# Altium project mcHF_rf.PrjPCB
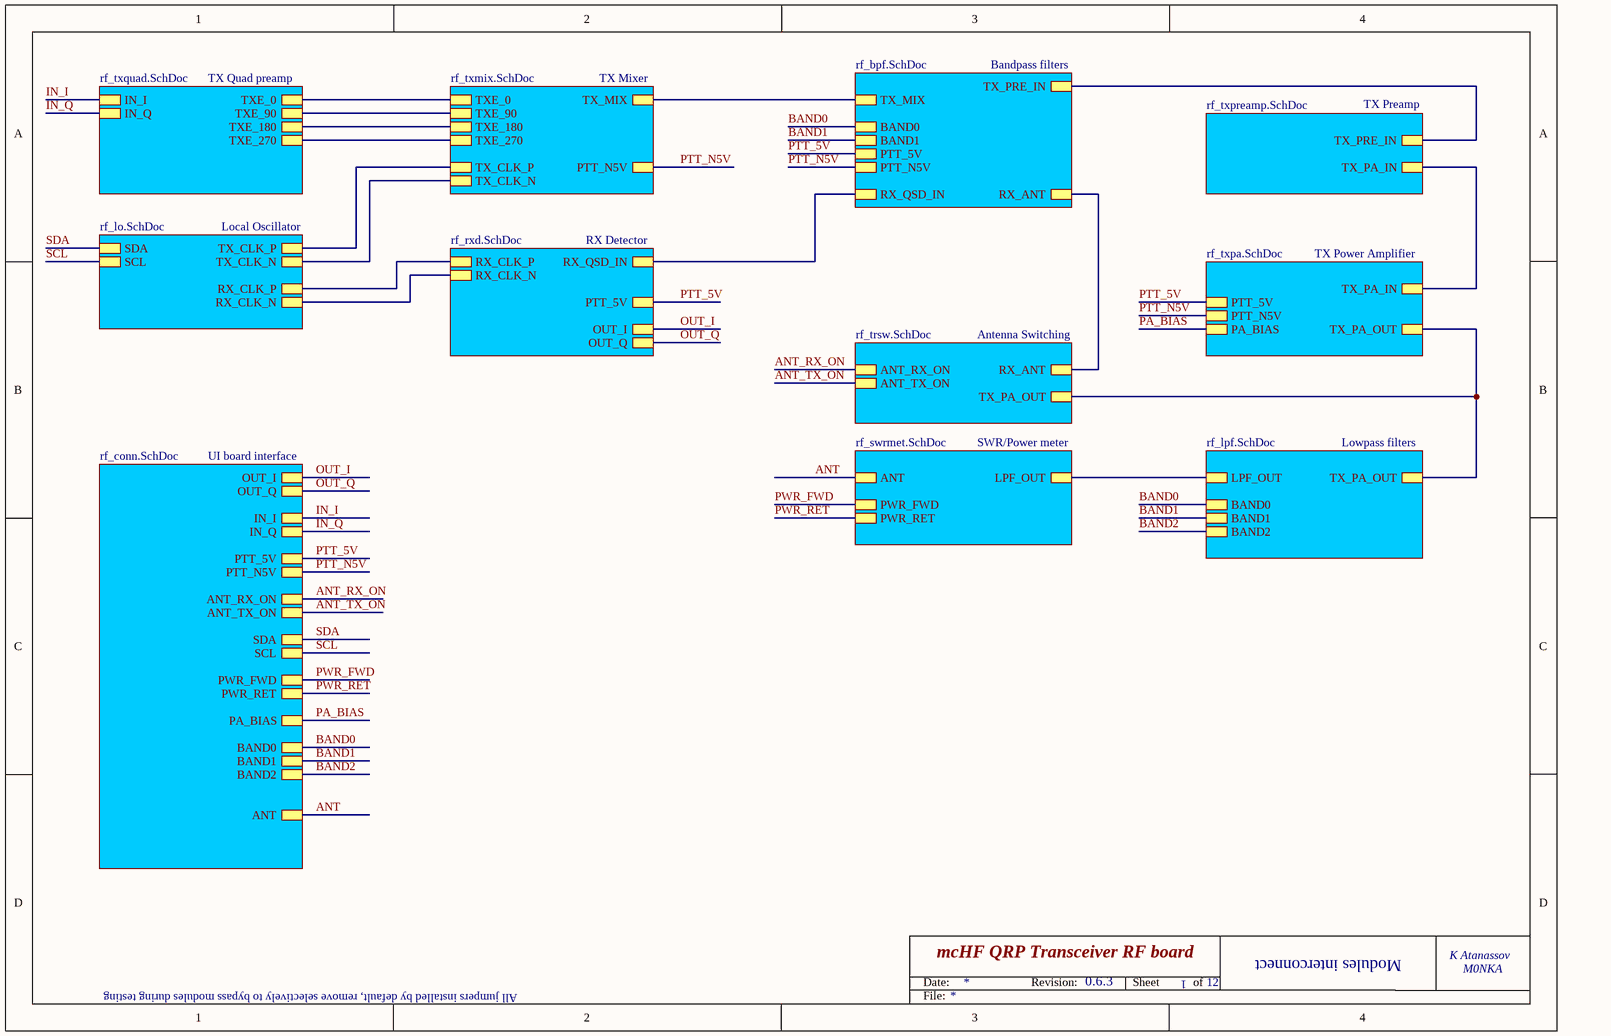
[diagram p0: rf_main.SchDoc]
6 sheets, 174 parts. Net scope: hierarchical (ports join the sheet entries above them; power ports are global).
Board file: rf_main.PcbDoc
Sheets:
  rf_main.SchDoc
    TX Power Amplifier = rf_txpa.SchDoc
    Bandpass filters = rf_bpf.SchDoc
    UI board interface = rf_conn.SchDoc
    TX Mixer = rf_txmix.SchDoc
    Antenna Switching = rf_trsw.SchDoc

## Sheet rf_main.SchDoc: mcHF QRP Transceiver RF board
size A4; Author: K Atanassov; CompanyName: M0NKA; Revision: 0.6.3; SheetTotal: 12

### Sub-sheets
Antenna Switching = rf_trsw.SchDoc: RX_ANT, ANT_RX_ON, ANT_TX_ON, TX_PA_OUT
Bandpass filters = rf_bpf.SchDoc: RX_QSD_IN, BAND0, BAND1, PTT_5V, RX_ANT, TX_MIX, TX_PRE_IN, PTT_N5V
Local Oscillator = rf_lo.SchDoc (file not in this document): SDA, SCL, RX_CLK_N, RX_CLK_P, TX_CLK_P, TX_CLK_N
Lowpass filters = rf_lpf.SchDoc (file not in this document): TX_PA_OUT, LPF_OUT, BAND0, BAND1, BAND2
RX Detector = rf_rxd.SchDoc (file not in this document): RX_QSD_IN, OUT_I, OUT_Q, PTT_5V, RX_CLK_N, RX_CLK_P
SWR/Power meter = rf_swrmet.SchDoc (file not in this document): ANT, LPF_OUT, PWR_FWD, PWR_RET
TX Mixer = rf_txmix.SchDoc: PTT_N5V, TX_MIX, TXE_270, TXE_180, TXE_90, TXE_0, TX_CLK_P, TX_CLK_N
TX Power Amplifier = rf_txpa.SchDoc: TX_PA_IN, PA_BIAS, TX_PA_OUT, PTT_N5V, PTT_5V
TX Preamp = rf_txpreamp.SchDoc (file not in this document): TX_PRE_IN, TX_PA_IN
TX Quad preamp = rf_txquad.SchDoc (file not in this document): IN_I, IN_Q, TXE_0, TXE_90, TXE_180, TXE_270
UI board interface = rf_conn.SchDoc: OUT_I, OUT_Q, IN_I, IN_Q, PTT_5V, PTT_N5V, SDA, SCL, PWR_FWD, PWR_RET, PA_BIAS, BAND0, BAND1, ANT, BAND2, ANT_RX_ON, ANT_TX_ON

### Nets
ANT: sheet UI board interface/ANT, sheet SWR/Power meter/ANT
ANT_RX_ON: sheet UI board interface/ANT_RX_ON, sheet Antenna Switching/ANT_RX_ON
ANT_TX_ON: sheet UI board interface/ANT_TX_ON, sheet Antenna Switching/ANT_TX_ON
BAND0: sheet Bandpass filters/BAND0, sheet Lowpass filters/BAND0, sheet UI board interface/BAND0
BAND1: sheet Bandpass filters/BAND1, sheet Lowpass filters/BAND1, sheet UI board interface/BAND1
BAND2: sheet Lowpass filters/BAND2, sheet UI board interface/BAND2
IN_I: sheet TX Quad preamp/IN_I, sheet UI board interface/IN_I
IN_Q: sheet TX Quad preamp/IN_Q, sheet UI board interface/IN_Q
OUT_I: sheet RX Detector/OUT_I, sheet UI board interface/OUT_I
OUT_Q: sheet RX Detector/OUT_Q, sheet UI board interface/OUT_Q
PA_BIAS: sheet TX Power Amplifier/PA_BIAS, sheet UI board interface/PA_BIAS
PTT_5V: sheet TX Power Amplifier/PTT_5V, sheet RX Detector/PTT_5V, sheet Bandpass filters/PTT_5V, sheet UI board interface/PTT_5V  [project net PTT]
PTT_N5V: sheet TX Power Amplifier/PTT_N5V, sheet Bandpass filters/PTT_N5V, sheet UI board interface/PTT_N5V, sheet TX Mixer/PTT_N5V  [project net PTT_N]
PWR_FWD: sheet UI board interface/PWR_FWD, sheet SWR/Power meter/PWR_FWD
PWR_RET: sheet UI board interface/PWR_RET, sheet SWR/Power meter/PWR_RET
SCL: sheet Local Oscillator/SCL, sheet UI board interface/SCL
SDA: sheet Local Oscillator/SDA, sheet UI board interface/SDA
NetC1_1: sheet Bandpass filters/RX_ANT, sheet Antenna Switching/RX_ANT
NetC2_1: sheet Bandpass filters/TX_MIX, sheet TX Mixer/TX_MIX
NetC23_1: sheet RX Detector/RX_QSD_IN, sheet Bandpass filters/RX_QSD_IN
NetC24_1: sheet Bandpass filters/TX_PRE_IN, sheet TX Preamp/TX_PRE_IN
NetC78_2: sheet TX Power Amplifier/TX_PA_OUT, sheet Lowpass filters/TX_PA_OUT, sheet Antenna Switching/TX_PA_OUT
NetR63_1: sheet TX Quad preamp/TXE_0, sheet TX Mixer/TXE_0
NetR64_1: sheet TX Quad preamp/TXE_180, sheet TX Mixer/TXE_180
NetR65_1: sheet TX Quad preamp/TXE_90, sheet TX Mixer/TXE_90
NetR66_1: sheet TX Quad preamp/TXE_270, sheet TX Mixer/TXE_270
NetR71_2: sheet Local Oscillator/TX_CLK_P, sheet TX Mixer/TX_CLK_P
NetR72_2: sheet Local Oscillator/TX_CLK_N, sheet TX Mixer/TX_CLK_N
NetT5_6: sheet TX Power Amplifier/TX_PA_IN, sheet TX Preamp/TX_PA_IN
(unnamed): sheet RX Detector/RX_CLK_N, sheet Local Oscillator/RX_CLK_N
(unnamed): sheet RX Detector/RX_CLK_P, sheet Local Oscillator/RX_CLK_P
(unnamed): sheet Lowpass filters/LPF_OUT, sheet SWR/Power meter/LPF_OUT

### Notes on the sheet
- All jumpers installed by default, remove selectively to bypass modules during testing
- 1
- Modules interconnect
- Date:
- Revision:
- Sheet
- of
- File:

## Sheet rf_txpa.SchDoc: mcHF QRP Transceiver RF board
size A4; Author: K Atanassov; CompanyName: M0NKA; Revision: 0.6.3; SheetTotal: 12
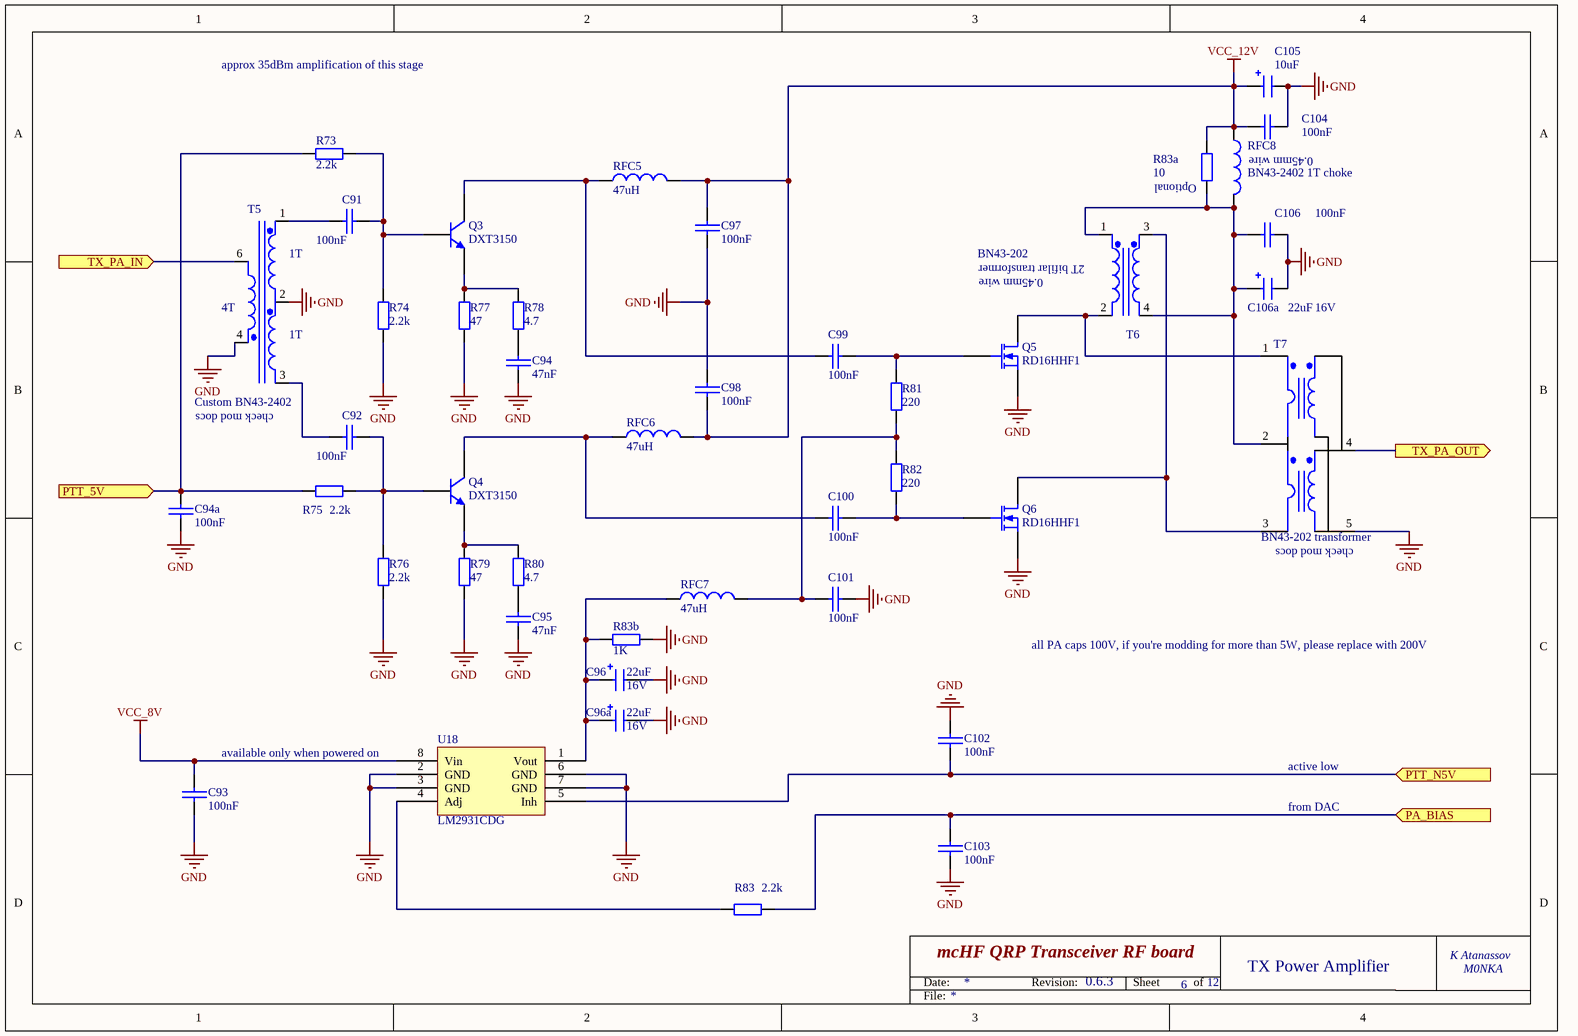
[diagram p1: rf_txpa.SchDoc]

### Parts
C91  100nF  [0805-Pro]
C92  100nF  [0805-Pro]
C93  100nF  [0805-Pro]
C94  47nF  [0805-Pro]
C94a  100nF  [0805-Pro]
C95  47nF  [0805-Pro]
C96  22uF  Voltage: 16V  [1206_Elec_Cap_N]
C96a  22uF  Voltage: 16V  [1206_Elec_Cap_N]
C97  100nF  [0805-Pro]
C98  100nF  [0805-Pro]
C99  100nF  [0805-Pro]
C100  100nF  [0805-Pro]
C101  100nF  [0805-Pro]
C102  100nF  [0805-Pro]
C103  100nF  [0805-Pro]
C104  100nF  [0805-Pro]
C105  10uF  [1206_Elec_Cap_N]
C106  100nF  [0805-Pro]
C106a  22uF  Voltage: 16V  [1206_Elec_Cap_N]
Q3  DXT3150  [SOT89L_new]
Q4  DXT3150  [SOT89L_new]
Q5  RD16HHF1  [TO-220RF_dual]
Q6  RD16HHF1  [TO-220RF_dual]
R73  2.2k  [0805-Pro]
R74  2.2k  [0805-Pro]
R75  2.2k  [0805-Pro]
R76  2.2k  [0805-Pro]
R77  47  [0805-Pro]
R78  4.7  [0805-Pro]
R79  47  [0805-Pro]
R80  4.7  [0805-Pro]
R81  220  [0805-Pro]
R82  220  [0805-Pro]
R83  2.2k  [0805-Pro]
R83a  10  [0805-Pro]
R83b  1K  [0805-Pro]
RFC5  47uH  [0805-Pro]
RFC6  47uH  [0805-Pro]
RFC7  47uH  [0805-Pro]
RFC8  BN43-2402 1T choke  [F_Bead]
T5  Custom BN43-2402  [SOP5_NEW1thr]
T6  BN43-202  [PA_TRM_b1]
T7  BN43-202 transformer  [PA_TRM_4m]
U18  LM2931CDG  [SO-8-Pro]

### Ports
PA_BIAS (in), PTT_5V (in), PTT_N5V (in), TX_PA_IN (in), TX_PA_OUT (out)

### Nets
GND: C93.2 C94.2 C94a.2 C95.2 C96.2 C96a.2 C97.2 C98.1 C101.1 C102.1 C103.2 C104.1 C105.2 C106.1 C106a.2 Q5.2(S) Q6.2(S) R74.2 R76.2 R77.1 R79.1 R83b.1 T5.2(SecCmn) T5.4(Pri-) T7.5(Sec-) U18.2(GND) U18.3(GND) U18.6(GND) U18.7(GND)
VCC_8V: C93.1 U18.8(Vin)
VCC_12V: C97.1 C98.2 C104.2 C105.1 R83a.2 RFC5.2 RFC6.2 RFC8.1
PA_BIAS: C103.1 R83.2 ; port PA_BIAS
PTT: C94a.1 R73.2 R75.1 ; port PTT_5V
PTT_N: C102.2 U18.5(Inh) ; port PTT_N5V
NetC78_2: T7.4(Sec+) ; port TX_PA_OUT
NetC91_1: C91.1 Q3.1(B) R73.1 R74.1
NetC91_2: C91.2 T5.1(Sec0)
NetC92_1: C92.1 Q4.1(B) R75.2 R76.1
NetC92_2: C92.2 T5.3(Sec180)
NetC94_1: C94.1 R78.1
NetC95_1: C95.1 R80.1
NetC96_1: C96.1 C96a.1 R83b.2 RFC7.1 U18.1(Vout)
NetC99_1: C99.1 Q5.1(G) R81.2
NetC99_2: C99.2 Q3.2(C) RFC5.1
NetC100_1: C100.1 Q6.1(G) R82.1
NetC100_2: C100.2 Q4.2(C) RFC6.1
NetC101_2: C101.2 R81.1 R82.2 RFC7.2
NetC106_2: C106.2 C106a.1 R83a.1 RFC8.2 T6.1(Pri+) T6.4(Sec-) T7.2(Pri_Common)
NetQ3_3: Q3.3(E) R77.2 R78.2
NetQ4_3: Q4.3(E) R79.2 R80.2
NetQ5_3: Q5.3(D) T6.2(Pri-) T7.1(Pri_0_deg)
NetQ6_3: Q6.3(D) T6.3(Sec+) T7.3(Pri_180_deg)
NetR83_1: R83.1 U18.4(Adj)
NetT5_6: T5.6(Pri+) ; port TX_PA_IN

### Notes on the sheet
- approx 35dBm amplification of this stage
- (near R83a) Optional
- (near RFC8) 0.45mm wire
- (near T5) 4T
- (near T5) 1T
- (near T6) 2T bifilar transformer
- 0.45mm wire
- (near T5) check mod docs
- (near T7) check mod docs
- all PA caps 100V, if you're modding for more than 5W, please replace with 200V
- available only when powered on
- active low
- from DAC
- 9
- TX Power Amplifier
- Date:
- Revision:
- Sheet
- of
- File:

### Library data of the parts
C91-C93 C94a C97-C104 C106 = CAP: Capacitor; Order: FN 252-2090; Voltage: 100V; QT Order: QCC-00154; Price: 0.068
C94 C95 = CAP: Capacitor; Order: FN 152-0303; QT Order: QCC-00101; Price: 0.03
C96 C96a C106a = CAP-POL: Electrolitic capacitor; Order: FN 197-294; QT Order: QCC-00202; Price: 0.235
C105 = CAP-POL: Electrolitic capacitor; Order: FN 233-3009; QT Order: QCC-00166; Price: 0.204
Q3 Q4 = DXT3150: BIPOLAR, TRANSISTOR, NPN, SOT-89; Order: FN 171-3880; Price: 0.221
Q5 Q6 = RD16HHF1: Silicon RF Power MOS FET; Order: EB 121171160336; Price: 7.375
R73-R76 R83 = RES: Resistor; Order: FN 188-7289; QT Order: QCR-00333; Price: 0.046
R77 R79 = RES: Resistor; Order: FN 173-8942; QT Order: QCR-00293; Price: 0.052
R78 R80 = RES: Resistor; Order: FN 205-7665; QT Order: QCR-00274; Price: 0.018
R81 R82 = RES: Resistor; Order: FN 933-2804; QT Order: QCR-00309; Price: 0.007
R83a = RES: Resistor; Order: FN 933-2421; QT Order: QCR-00279; Price: 0.013
R83b = RES: Resistor; Order: FN 157-6459; QT Order: QCR-00326; Price: 0.061
RFC5-RFC7 = TDK-NLV25T: INDUCTOR, SIGNAL LINE, 4.7UH, 1005; Order: FN 166-9895; Price: 0.166
RFC8 = FER_BEAD: Order: EB 300988432524; Price: 0.298
T5 = CX2074NL: Transformer 4:1; Order: EB 300988432524; Price: 0.298
T6 = PA_TR_b: BN43-202 bifilar transformer; Order: EB 291023830340; Price: 0.534
T7 = PA_TR_4m: BN43-202 2:3 transformer; Order: EB 291023830340; Price: 0.534
U18 = LM2931CDG: 100 mA, Adjustable Output,  LDO Voltage Regulator with  60 V Load Dump Protection; Order: FN 121-1100; Price: 0.39

## Sheet rf_bpf.SchDoc: mcHF QRP Transceiver RF board
size A4; Author: K Atanassov; CompanyName: M0NKA; Revision: 0.6.3; SheetTotal: 12
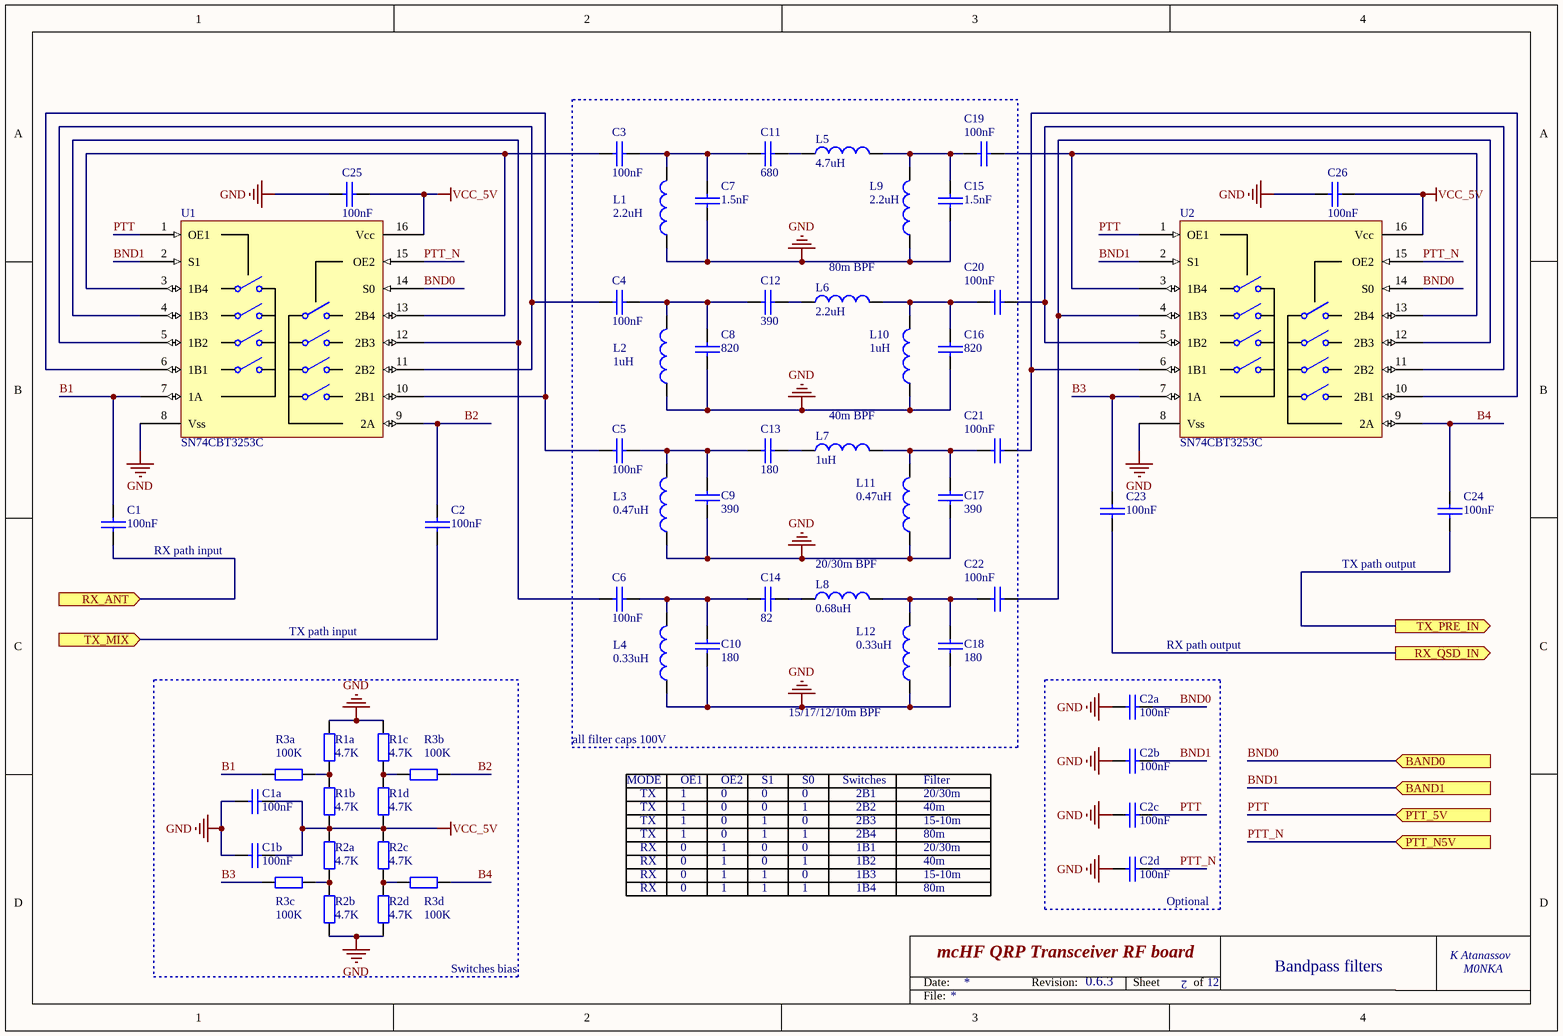
[diagram p2: rf_bpf.SchDoc]

### Parts
C1  100nF  [0805-Pro]
C1a  100nF  [0805-Pro]
C1b  100nF  [0805-Pro]
C2  100nF  [0805-Pro]
C2a  100nF  [0805-Pro]
C2b  100nF  [0805-Pro]
C2c  100nF  [0805-Pro]
C2d  100nF  [0805-Pro]
C3  100nF  [0805-Pro]
C4  100nF  [0805-Pro]
C5  100nF  [0805-Pro]
C6  100nF  [0805-Pro]
C7  1.5nF  [0805-Pro]
C8  820  [0805-Pro]
C9  390  [0805-Pro]
C10  180  [0805-Pro]
C11  680  [0805-Pro]
C12  390  [0805-Pro]
C13  180  [0805-Pro]
C14  82  [0805-Pro]
C15  1.5nF  [0805-Pro]
C16  820  [0805-Pro]
C17  390  [0805-Pro]
C18  180  [0805-Pro]
C19  100nF  [0805-Pro]
C20  100nF  [0805-Pro]
C21  100nF  [0805-Pro]
C22  100nF  [0805-Pro]
C23  100nF  [0805-Pro]
C24  100nF  [0805-Pro]
C25  100nF  [0805-Pro]
C26  100nF  [0805-Pro]
L1  2.2uH  [0805-Pro]
L2  1uH  [0805-Pro]
L3  0.47uH  [0805-Pro]
L4  0.33uH  [0805-Pro]
L5  4.7uH  [0805-Pro]
L6  2.2uH  [0805-Pro]
L7  1uH  [0805-Pro]
L8  0.68uH  [0805-Pro]
L9  2.2uH  [0805-Pro]
L10  1uH  [0805-Pro]
L11  0.47uH  [0805-Pro]
L12  0.33uH  [0805-Pro]
R1a  4.7K  [0805-Pro]
R1b  4.7K  [0805-Pro]
R1c  4.7K  [0805-Pro]
R1d  4.7K  [0805-Pro]
R2a  4.7K  [0805-Pro]
R2b  4.7K  [0805-Pro]
R2c  4.7K  [0805-Pro]
R2d  4.7K  [0805-Pro]
R3a  100K  [0805-Pro]
R3b  100K  [0805-Pro]
R3c  100K  [0805-Pro]
R3d  100K  [0805-Pro]
U1  SN74CBT3253C  [SO-16-Pro]
U2  SN74CBT3253C  [SO-16-Pro]

### Blocks framed on the sheet
Switches bias: C1a C1b R1a R1b R1c R1d R2a R2b R2c R2d R3a R3b R3c R3d
Optional: C2a C2b C2c C2d

### Ports
BAND0 (in), BAND1 (in), PTT_5V (in), PTT_N5V (in), RX_ANT (in), RX_QSD_IN (out), TX_MIX (in), TX_PRE_IN (out)

### Nets
GND: C1a.2 C1b.2 C2a.2 C2b.2 C2c.2 C2d.2 C7.2 C8.2 C9.1 C10.1 C15.2 C16.2 C17.1 C18.1 C25.2 C26.2 L1.1 L2.1 L3.1 L4.1 L9.1 L10.1 L11.1 L12.1 R1a.1 R1c.1 R2b.2 R2d.2 U1.8(Vss) U2.8(Vss)
VCC_5V: C1a.1 C1b.1 C25.1 C26.1 R1b.2 R1d.2 R2a.1 R2c.1 U1.16(Vcc) U2.16(Vcc)
B1: C1.2 R3a.1 U1.7(1A)
B2: C2.2 R3b.2 U1.9(2A)
B3: C23.2 R3c.1 U2.7(1A)
B4: C24.2 R3d.2 U2.9(2A)
BND0: C2a.1 U1.14(S0) U2.14(S0) ; port BAND0  [project net BAND0]
BND1: C2b.1 U1.2(S1) U2.2(S1) ; port BAND1  [project net BAND1]
PTT: C2c.1 U1.1(OE1) U2.1(OE1) ; port PTT_5V
PTT_N: C2d.1 U1.15(OE2) U2.15(OE2) ; port PTT_N5V
NetC1_1: C1.1 ; port RX_ANT
NetC2_1: C2.1 ; port TX_MIX
NetC3_1: C3.1 C7.1 C11.1 L1.2
NetC3_2: C3.2 U1.3(1B4) U1.13(2B4)
NetC4_1: C4.1 C8.1 C12.1 L2.2
NetC4_2: C4.2 U1.5(1B2) U1.11(2B2)
NetC5_1: C5.1 C9.2 C13.1 L3.2
NetC5_2: C5.2 U1.6(1B1) U1.10(2B1)
NetC6_1: C6.1 C10.2 C14.1 L4.2
NetC6_2: C6.2 U1.4(1B3) U1.12(2B3)
NetC11_2: C11.2 L5.1
NetC12_2: C12.2 L6.1
NetC13_2: C13.2 L7.1
NetC14_2: C14.2 L8.1
NetC15_1: C15.1 C19.2 L5.2 L9.2
NetC16_1: C16.1 C20.2 L6.2 L10.2
NetC17_2: C17.2 C21.2 L7.2 L11.2
NetC18_2: C18.2 C22.2 L8.2 L12.2
NetC19_1: C19.1 U2.3(1B4) U2.13(2B4)
NetC20_1: C20.1 U2.5(1B2) U2.11(2B2)
NetC21_1: C21.1 U2.6(1B1) U2.10(2B1)
NetC22_1: C22.1 U2.4(1B3) U2.12(2B3)
NetC23_1: C23.1 ; port RX_QSD_IN
NetC24_1: C24.1 ; port TX_PRE_IN
NetR1a_2: R1a.2 R1b.1 R3a.2
NetR1c_2: R1c.2 R1d.1 R3b.1
NetR2a_2: R2a.2 R2b.1 R3c.2
NetR2c_2: R2c.2 R2d.1 R3d.1

### Notes on the sheet
- (near L6) 80m BPF
- (near L7) 40m BPF
- (near C1) RX path input
- 20/30m BPF
- (near C24) TX path output
- TX path input
- RX path output
- (near L12) 15/17/12/10m BPF
- all filter caps 100V
- MODE
- OE1
- OE2
- S1
- S0
- Switches
- Filter
- TX
- RX
- 1
- 0
- 2B1
- 2B2
- 2B4
- 2B3
- 1B1
- 20/30m
- 40m
- 15-10m
- 80m
- 1B2
- 1B3
- 1B4
- 2
- Bandpass filters
- Date:
- Revision:
- Sheet
- of
- File:

### Library data of the parts
C1 C1a C1b C2 C2a C2b C2c C2d C3-C6 C19-C26 = CAP: Capacitor; Order: FN 252-2090; QT Order: QCC-00154; Price: 0.068
C7 C15 = CAP: Capacitor; Order: FN 221-0934; Price: 0.124
C8 C16 = CAP: Capacitor; Order: FN 174-0649; QT Order: QCC-00147; Price: 0.074
C9 C12 C17 = CAP: Capacitor; Order: FN 233-2701; QT Order: QCC-00125; Price: 0.078
C10 C13 C18 = CAP: Capacitor; Order: FN 233-2756; QT Order: QCC-00084; Price: 0.058
C11 = CAP: Capacitor; Order: FN 228-0662; Price: 0.074
C14 = CAP: Capacitor; Order: FN 174-0656; QT Order: QCC-00069; Price: 0.074
L1 L6 L9 = BPF_IND: INDUCTOR SMD; Order: FN 166-9889; Price: 0.166
L2 L7 L10 = BPF_IND: INDUCTOR SMD; Order: FN 166-9882; Price: 0.166
L3 L11 = BPF_IND: INDUCTOR SMD; Order: FN 166-9913; Price: 0.166
L4 L12 = BPF_IND: INDUCTOR SMD; Order: FN 166-9911; Price: 0.166
L5 = BPF_IND: INDUCTOR SMD; Order: FN 249-1624; Price: 0.166
L8 = BPF_IND: INDUCTOR SMD; Order: FN 166-9915; Price: 0.166
R1a R1b R1c R1d R2a R2b R2c R2d = RES: Resistor; Order: FN 200-8383; QT Order: QCR-00341; Price: 0.024
R3a R3b R3c R3d = RES: Resistor; Order: FN 146-9860; QT Order: QCR-00373; Price: 0.021
U1 U2 = SN74CBT3253C: Dual 4:1 Demux/Analog Switch; Order: FN 175-0447; Price: 0.69

## Sheet rf_conn.SchDoc: mcHF QRP Transceiver RF board
size A4; Author: K Atanassov; CompanyName: M0NKA; Revision: 0.6.3; SheetTotal: 12
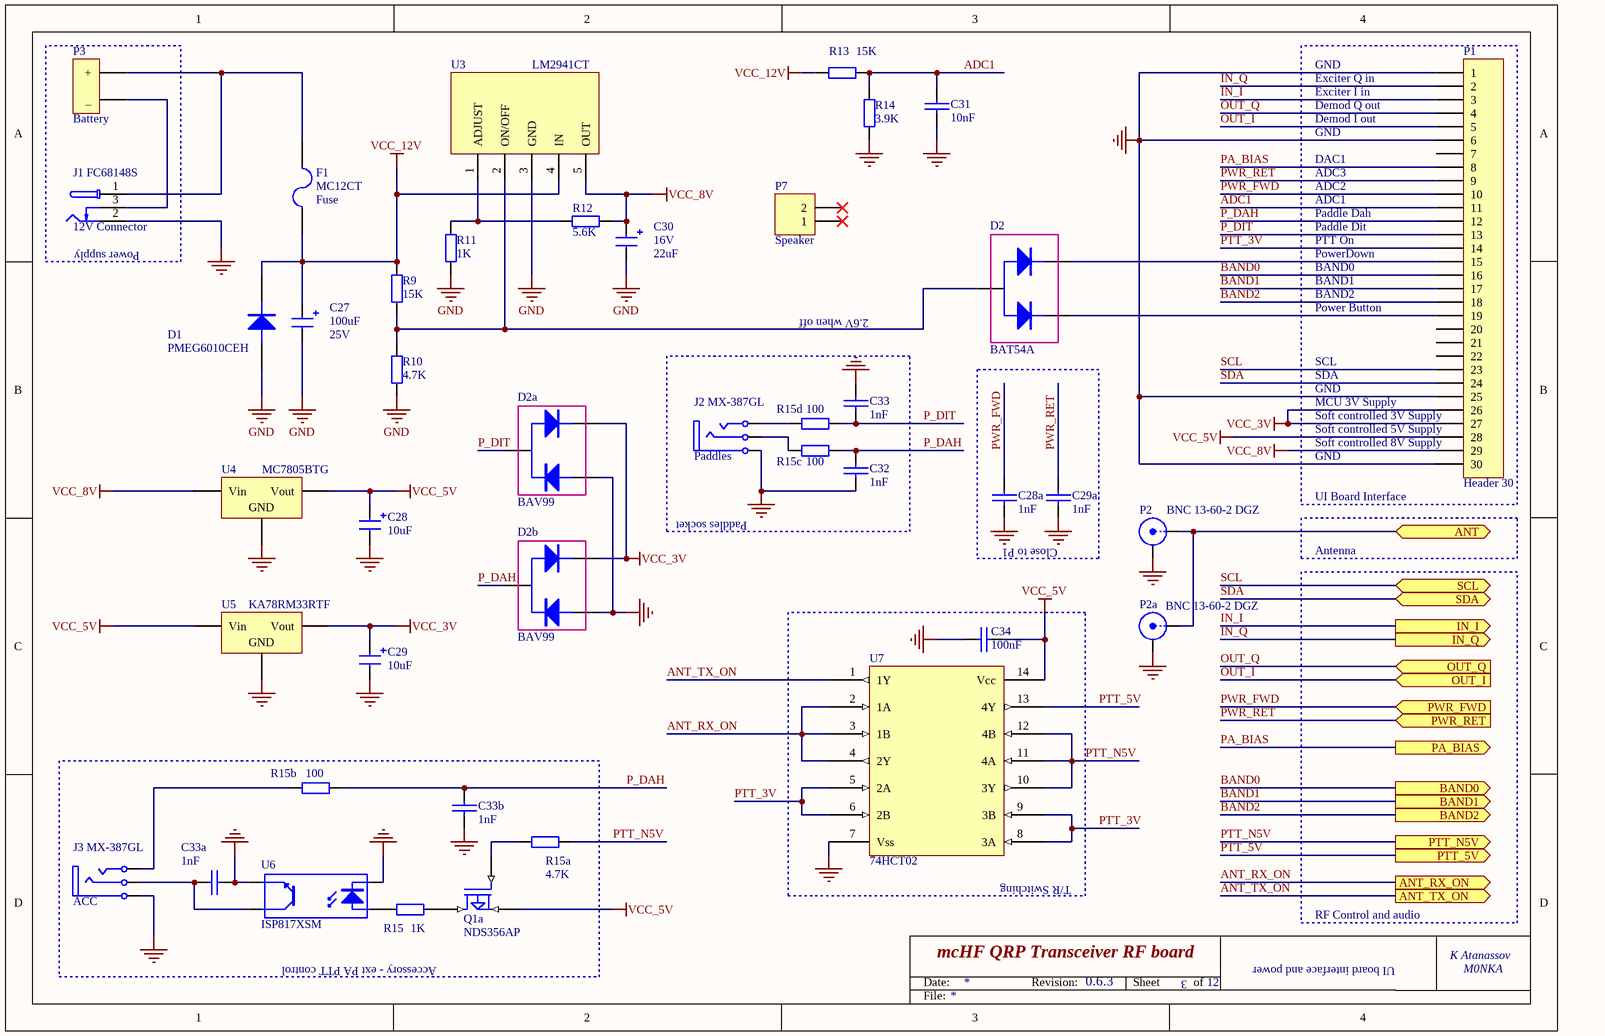
[diagram p3: rf_conn.SchDoc]

### Parts
C27  100uF  Voltage: 25V  [CAP_ALUM_1]
C28  10uF  [1206_Elec_Cap_N]
C28a  1nF  [0805-Pro]
C29  10uF  [1206_Elec_Cap_N]
C29a  1nF  [0805-Pro]
C30  22uF  Voltage: 16V  [1206_Elec_Cap_N]
C31  10nF  [0805-Pro]
C32  1nF  [0805-Pro]
C33  1nF  [0805-Pro]
C33a  1nF  [0805-Pro]
C33b  1nF  [0805-Pro]
C34  100nF  [0805-Pro]
D1  PMEG6010CEH  [SOD87]
D2  BAT54A  [SOT-23]
D2a  BAV99  [SOT-23]
D2b  BAV99  [SOT-23]
F1  MC12CT  [1206]
J1  FC68148S  Function: 12V Connector  [PowerJack]
J2  MX-387GL  Function: Paddles  [MX-387GL_new1]
J3  MX-387GL  Function: ACC  [MX-387GL_new1]
P1  Header 30  [HDR1X30]
P2  BNC 13-60-2 DGZ  [CON-SMA-RA-A]
P2a  BNC 13-60-2 DGZ  [BNC_RA CON]
P3  Battery  [BatteryTerminal]  (no BOM)
P7  Speaker  [SIP2]
Q1a  NDS356AP  [SOT-23-Pro]
R9  15K  [0805-Pro]
R10  4.7K  [0805-Pro]
R11  1K  [0805-Pro]
R12  5.6K  [0805-Pro]
R13  15K  [0805-Pro]
R14  3.9K  [0805-Pro]
R15  1K  [0805-Pro]
R15a  4.7K  [0805-Pro]
R15b  100  [0805-Pro]
R15c  100  [0805-Pro]
R15d  100  [0805-Pro]
U3  LM2941CT  [TO-220-5]
U4  MC7805BTG  [TO-220]
U5  KA78RM33RTF  [TO-252]
U6  ISP817XSM  [SMDIP-4_new1]
U7  74HCT02  [SO-14-Pro]

### Blocks framed on the sheet
Power supply: J1 P3
Paddles socket: C32 C33 J2 R15c R15d
Close to P1: C28a C29a
T/R Switching: C34 U7
Accessory - ext PA PTT control: C33a C33b J3 Q1a R15 R15a R15b U6

### Ports
ANT (bidir), ANT_RX_ON (out), ANT_TX_ON (out), BAND0 (out), BAND1 (out), BAND2 (out), IN_I (out), IN_Q (out), OUT_I (in), OUT_Q (in), PA_BIAS (out), PTT_5V (out), PTT_N5V (out), PWR_FWD (in), PWR_RET (in), SCL (bidir), SDA (bidir)

### Nets
GND: C27.2 C28.2 C28a.1 C29.2 C29a.1 C30.2 C31.2 C32.1 C33.2 C33a.1 C33b.2 C34.2 D1.1(A) D2a.1(A1) D2b.1(A1) J1.2 J2.S J3.S P1.1 P1.6 P1.25 P1.30 P2.2(Y) P2a.2(Y) R10.2 R11.1 R14.2 U3.3(GND) U4.2(GND) U5.2(GND) U6.2(K) U6.3(E) U7.7(Vss)
VCC_3V: C29.1 D2a.2(K1) D2b.2(K1) P1.26 P1.27 U5.3(Vout)
VCC_5V: C28.1 C34.1 P1.28 Q1a.2(S) U4.3(Vout) U5.1(Vin) U7.14(Vcc)
VCC_8V: C30.1 P1.29 R12.2 U3.5(OUT) U4.1(Vin)
VCC_12V: C27.1 D1.2(K) F1.1 R9.2 R13.1 U3.4(IN)
ADC1: C31.1 P1.11 R13.2 R14.1
ANT: P2.1(X) P2a.1(X) ; port ANT
ANT_RX_ON: U7.2(1A) U7.3(1B) U7.4(2Y) ; port ANT_RX_ON
ANT_TX_ON: U7.1(1Y) ; port ANT_TX_ON
BAND0: P1.16 ; port BAND0
BAND1: P1.17 ; port BAND1
BAND2: P1.18 ; port BAND2
IN_I: P1.3 ; port IN_I
IN_Q: P1.2 ; port IN_Q
OUT_I: P1.5 ; port OUT_I
OUT_Q: P1.4 ; port OUT_Q
P_DAH: C32.2 C33b.1 D2b.3(C) P1.12 R15b.1 R15c.1
P_DIT: C33.1 D2a.3(C) P1.13 R15d.1
PA_BIAS: P1.8 ; port PA_BIAS
PTT_3V: P1.14 U7.5(2A) U7.6(2B) U7.8(3A) U7.9(3B)
PTT_5V: U7.13(4Y) ; port PTT_5V  [project net PTT]
PTT_N5V: R15a.2 U7.10(3Y) U7.11(4A) U7.12(4B) ; port PTT_N5V  [project net PTT_N]
PWR_FWD: C28a.2 P1.10 ; port PWR_FWD
PWR_RET: C29a.2 P1.9 ; port PWR_RET
SCL: P1.23 ; port SCL
SDA: P1.24 ; port SDA
NetC33a_2: C33a.2 J3.R U6.4(C)
NetD2_1: D2.1(K1) P1.19
NetD2_2: D2.2(K2) P1.15
NetD2_3: D2.3(A) R9.1 R10.1 U3.2(ON/OFF)
NetF1_2: F1.2 J1.1 P3.1(+)
NetJ1_3: J1.3 P3.2(_)
NetJ2_R: J2.R R15c.2
NetJ2_T: J2.T R15d.2
NetJ3_T: J3.T R15b.2
NetQ1a_1: Q1a.1(G) R15a.1
NetQ1a_3: Q1a.3(D) R15.2
NetR11_2: R11.2 R12.1 U3.1(ADJUST)
NetR15_1: R15.1 U6.1(A)

Not connected (* = marked no-connect by the designer): P1 7 20 21 22; P7 1* 2*

### Notes on the sheet
- GND
- Exciter I in
- Exciter Q in
- Demod Q out
- Demod I out
- DAC1
- ADC3
- ADC2
- ADC1
- Paddle Dit
- Paddle Dah
- PTT On
- 2.6V when off
- PowerDown
- BAND0
- BAND1
- BAND2
- Power Button
- SCL
- SDA
- MCU 3V Supply
- (near P1) Soft controlled 3V Supply
- (near P1) Soft controlled 5V Supply
- (near P1) Soft controlled 8V Supply
- (near P1) UI Board Interface
- Antenna
- RF Control and audio
- 3
- UI board interface and power
- Date:
- Revision:
- Sheet
- of
- File:

### Library data of the parts
C27 = CAP-POL: Electrolitic capacitor; Order: FN 206-9181; QT Order: QCC-00323; Price: 0.37
C28 C29 = CAP-POL: as C105 on sheet rf_txpa; Price: 0.204
C28a C29a C32 C33 C33a C33b = CAP: Capacitor; Order: FN 136-2553; QT Order: QCC-00259; Price: 0.01
C30 = CAP-POL: as C96 on sheet rf_txpa; Price: 0.235
C31 = CAP: Capacitor; Order: FN 233-2713; QT Order: QCC-00097; Price: 0.059
C34 = CAP: as C1 on sheet rf_bpf; Price: 0.068
D1 = PMEG6010CEH: DIODE, SCHOTTKY, 1A, 60V, SOD-123F; Order: FN 151-0694; QT Order: QCD-00034; Price: 0.085
D2 = BAT54A: DIODE, SCHOTTKY, DUAL; Order: FN 108-1191; Price: 0.024
D2a D2b = BAV99: Small Signal Diode, Dual Series; Order: FN 162-1837; Price: 0.0618
F1 = Fuse: Order: FN 184-1065; QT Order: QCI-00216; Price: 0.134; Function: Fuse
J1 = POWER_JACK: Power Jack; Order: FN 188-9309; Price: 0.83
J2 J3 = Phonejack3: Jack Socket,Thru-Hole; Order: FN 126-7376; Price: 0.35
P1 = Header 30: Header, 30-Pin; Order: EB 290947876334; Price: 0.295
P2 P2a = BNC: RF COAXIAL, BNC, JACK; Order: FN 171-2350; Price: 0.69
P3 = Battery: Battery Terminal
P7 = Header 2: Header, 2-Pin; Order: FN 168-3898; Checked: NA; Price: 5.57
Q1a = NDS356AP: Order: FN 984-6409; QT Order: QCT-00010; Price: 0.31
R9 R13 = RES: Resistor; Order: FN 165-2920; QT Order: QCR-00353; Price: 0.065
R10 R15a = RES: as R1a on sheet rf_bpf; Price: 0.024
R11 R15 = RES: as R83b on sheet rf_txpa; Price: 0.061
R12 = RES: Resistor; Order: FN 188-7301; QT Order: QCR-00343; Price: 0.043
R14 = RES: Resistor; Order: FN 165-2998; QT Order: QCR-00339; Price: 0.012
R15b R15c R15d = RES: Resistor; Order: FN 933-2375; QT Order: QCR-00301; Price: 0.027
U3 = LM2941CT: V REG ADJ +5/20V, 2941, TO-220-5; Order: FN 948-9371; Price: 1.28
U4 = MC7805BTG: VOLTAGE REG, 40V, TO220-3; Order: FN 121-1135; Price: 0.56
U5 = UA78M33CKVURG3: VOLT REG, 3.3V, TO-252; Order: FN 245-1041; Price: 0.39
U6 = ISP817XSM: OPTOCOUPLER, SMDIP-4, TR O/P; Order: FN 168-3292; Price: 0.26
U7 = 74HCT02: Quad 2-input NOR gate; Order: FN 108-5298; Price: 0.38

## Sheet rf_txmix.SchDoc: mcHF QRP Transceiver RF board
size A4; Author: K Atanassov; CompanyName: M0NKA; Revision: 0.6.3; SheetTotal: 12
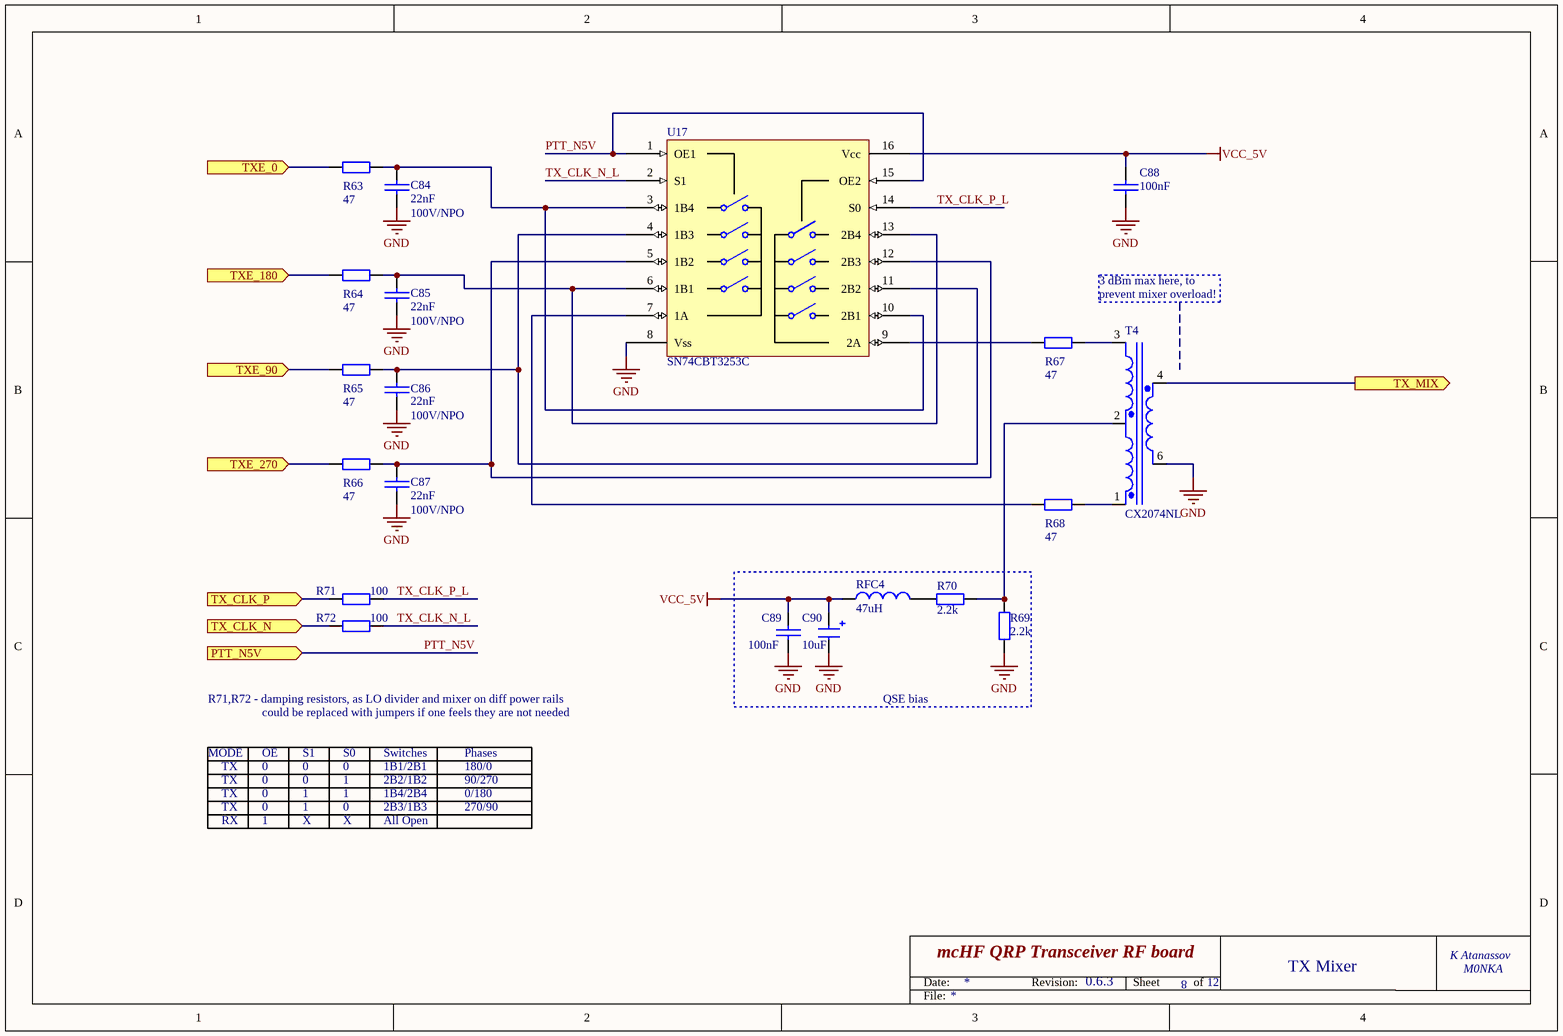
[diagram p4: rf_txmix.SchDoc]

### Parts
C84  22nF  Voltage: 100V/NPO  [CAP_B]
C85  22nF  Voltage: 100V/NPO  [CAP_B]
C86  22nF  Voltage: 100V/NPO  [CAP_B]
C87  22nF  Voltage: 100V/NPO  [CAP_B]
C88  100nF  [0805-Pro]
C89  100nF  [0805-Pro]
C90  10uF  [1206_Elec_Cap_N]
R63  47  [0805-Pro]
R64  47  [0805-Pro]
R65  47  [0805-Pro]
R66  47  [0805-Pro]
R67  47  [0805-Pro]
R68  47  [0805-Pro]
R69  2.2k  [0805-Pro]
R70  2.2k  [0805-Pro]
R71  100  [0805-Pro]
R72  100  [0805-Pro]
RFC4  47uH  [0805-Pro]
T4  CX2074NL  [SOP5_NEW1]
U17  SN74CBT3253C  [SO-16-Pro]

### Blocks framed on the sheet
QSE bias: C89 C90 R69 R70 RFC4

### Ports
PTT_N5V (in), TX_CLK_N (in), TX_CLK_P (in), TX_MIX (out), TXE_0 (in), TXE_90 (in), TXE_180 (in), TXE_270 (in)

### Nets
GND: C84.2 C85.2 C86.2 C87.2 C88.1 C89.1 C90.2 R69.1 T4.6(Pri+) U17.8(Vss)
VCC_5V: C88.2 C89.2 C90.1 RFC4.1 U17.16(Vcc)
PTT_N5V: U17.1(OE1) U17.15(OE2) ; port PTT_N5V  [project net PTT_N]
TX_CLK_N_L: R72.1 U17.2(S1)
TX_CLK_P_L: R71.1 U17.14(S0)
NetC2_1: T4.4(Pri-) ; port TX_MIX
NetC84_1: C84.1 R63.2 U17.3(1B4) U17.10(2B1)
NetC85_1: C85.1 R64.2 U17.6(1B1) U17.13(2B4)
NetC86_1: C86.1 R65.2 U17.4(1B3) U17.11(2B2)
NetC87_1: C87.1 R66.2 U17.5(1B2) U17.12(2B3)
NetR63_1: R63.1 ; port TXE_0
NetR64_1: R64.1 ; port TXE_180
NetR65_1: R65.1 ; port TXE_90
NetR66_1: R66.1 ; port TXE_270
NetR67_1: R67.1 U17.9(2A)
NetR67_2: R67.2 T4.3(Sec180)
NetR68_1: R68.1 U17.7(1A)
NetR68_2: R68.2 T4.1(Sec0)
NetR69_2: R69.2 R70.1 T4.2(SecCmn)
NetR70_2: R70.2 RFC4.2
NetR71_2: R71.2 ; port TX_CLK_P
NetR72_2: R72.2 ; port TX_CLK_N

### Notes on the sheet
- 3 dBm max here, to
- prevent mixer overload!
- R71,R72 - damping resistors, as LO divider and mixer on diff power rails
- could be replaced with jumpers if one feels they are not needed
- MODE
- TX
- 0
- OE
- S1
- S0
- 1
- Switches
- 1B1/2B1
- 2B2/1B2
- Phases
- 180/0
- 90/270
- RX
- X
- 2B3/1B3
- 1B4/2B4
- All Open
- 270/90
- 0/180
- 8
- TX Mixer
- Date:
- Revision:
- Sheet
- of
- File:

### Library data of the parts
C84-C87 = CAP: Capacitor; Order: FN 221-1120; Price: 0.84
C88 C89 = CAP: as C1 on sheet rf_bpf; Price: 0.068
C90 = CAP-POL: as C105 on sheet rf_txpa; Price: 0.204
R63-R68 = RES: as R77 on sheet rf_txpa; Price: 0.052
R69 R70 = RES: as R73 on sheet rf_txpa; Price: 0.046
R71 R72 = RES: as R15b on sheet rf_conn; Price: 0.027
RFC4 = TDK-NLV25T: as RFC5 on sheet rf_txpa; Price: 0.166
T4 = CX2074NL: Wideband RF Transformer 1:4; Order: DK 553-1655-ND; Price: 2.01
U17 = SN74CBT3253C: as U1 on sheet rf_bpf; Price: 0.69

## Sheet rf_trsw.SchDoc: mcHF QRP Transceiver RF board
size A4; Author: K Atanassov; CompanyName: M0NKA; Revision: 0.6.3; SheetTotal: 12
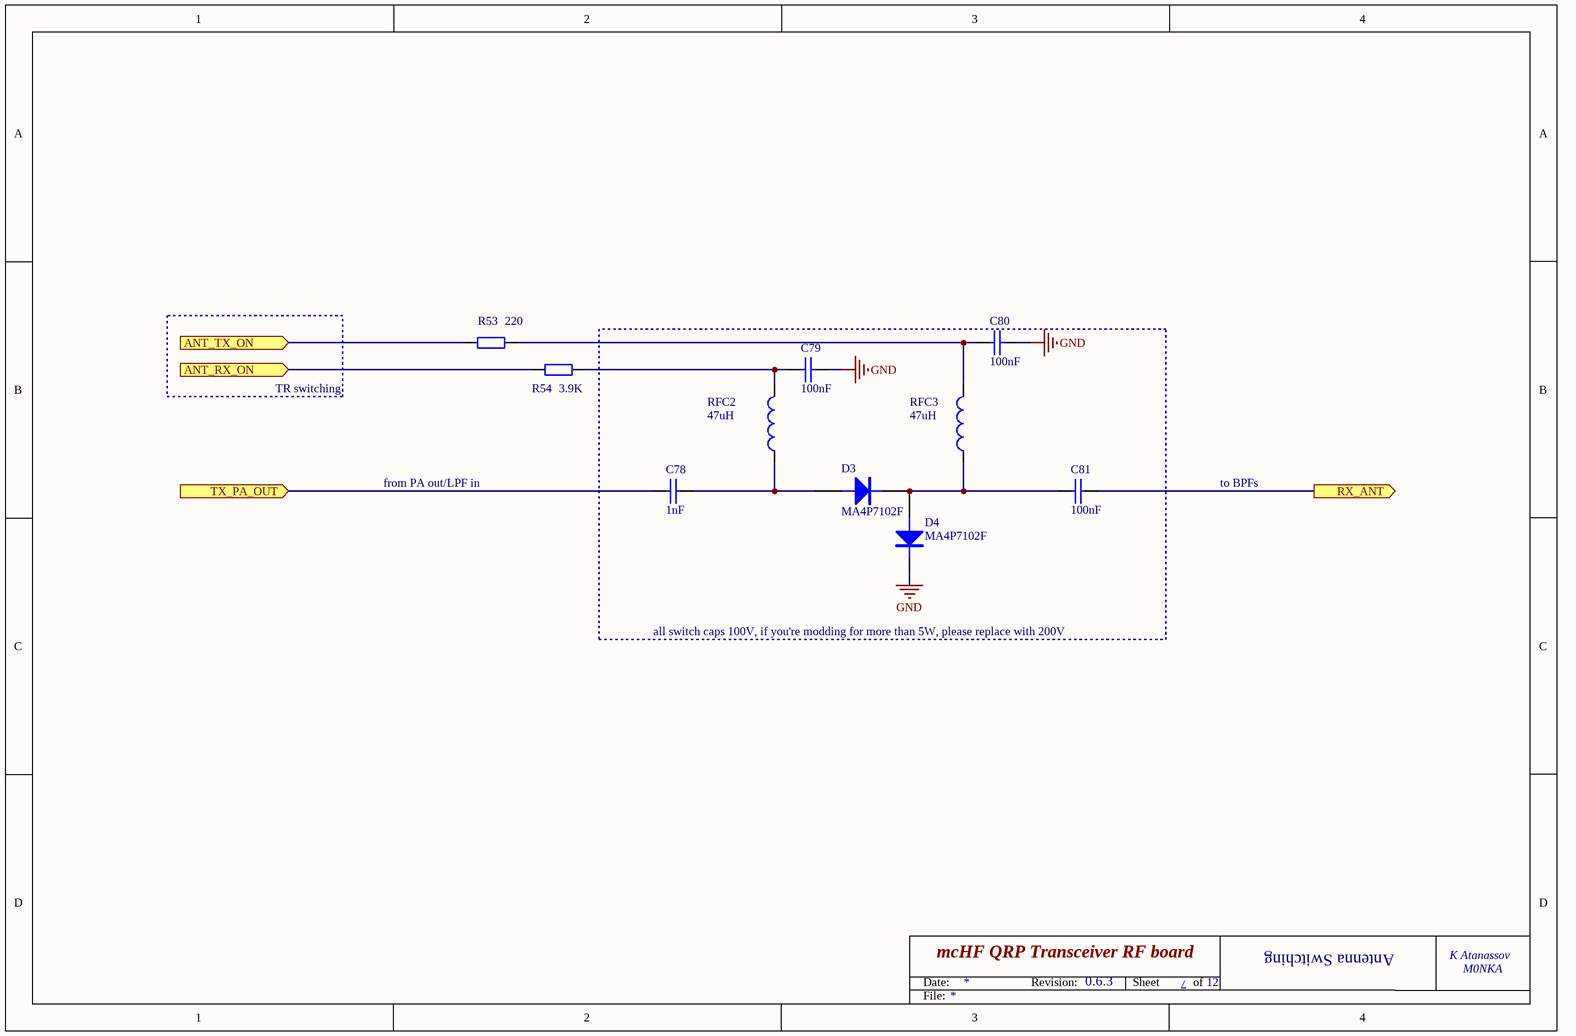
[diagram p5: rf_trsw.SchDoc]

### Parts
C78  1nF  [0805-Pro]
C79  100nF  [0805-Pro]
C80  100nF  [0805-Pro]
C81  100nF  [0805-Pro]
D3  MA4P7102F  [1072T]
D4  MA4P7102F  [1072T]
R53  220  [0805-Pro]
R54  3.9K  [0805-Pro]
RFC2  47uH  [0805-Pro]
RFC3  47uH  [0805-Pro]

### Ports
ANT_RX_ON (in), ANT_TX_ON (in), RX_ANT (out), TX_PA_OUT (in)

### Nets
GND: C79.1 C80.1 D4.1(K)
ANT_RX_ON: R54.1 ; port ANT_RX_ON
ANT_TX_ON: R53.2 ; port ANT_TX_ON
NetC1_1: C81.1 ; port RX_ANT
NetC78_1: C78.1 D3.2(A) RFC2.1
NetC78_2: C78.2 ; port TX_PA_OUT
NetC79_2: C79.2 R54.2 RFC2.2
NetC80_2: C80.2 R53.1 RFC3.2
NetC81_2: C81.2 D3.1(K) D4.2(A) RFC3.1

### Notes on the sheet
- TR switching
- from PA out/LPF in
- to BPFs
- all switch caps 100V, if you're modding for more than 5W, please replace with 200V
- 7
- Antenna Switching
- Date:
- Revision:
- Sheet
- of
- File:

### Library data of the parts
C78 = CAP: Capacitor; Order: FN 136-2553; Voltage: 100V; QT Order: QCC-00259; Price: 0.083
C79-C81 = CAP: as C91 on sheet rf_txpa; Price: 0.068
D3 D4 = MA4P7102F: MELF & HIPAX PIN Diod; Order: DK 1465-1236-1-ND; Price: 2.20
R53 = RES: as R81 on sheet rf_txpa; Price: 0.007
R54 = RES: as R14 on sheet rf_conn; Price: 0.012
RFC2 RFC3 = TDK-NLV25T: as RFC5 on sheet rf_txpa; Price: 0.166

## Nets that join several sheets
GND: rf_txpa (29 pins), rf_bpf (30 pins), rf_conn (33 pins), rf_txmix (10 pins), rf_trsw (C79.1 C80.1 D4.1)
VCC_5V: rf_bpf (10 pins), rf_conn (7 pins), rf_txmix (5 pins)
VCC_8V: rf_txpa (C93.1 U18.8), rf_conn (5 pins)
VCC_12V: rf_txpa (8 pins), rf_conn (6 pins)
ANT_RX_ON: rf_conn (U7.2 U7.3 U7.4), rf_trsw (R54.1)
ANT_TX_ON: rf_conn (U7.1), rf_trsw (R53.2)
BAND0: rf_bpf (C2a.1 U1.14 U2.14), rf_conn (P1.16)
BAND1: rf_bpf (C2b.1 U1.2 U2.2), rf_conn (P1.17)
NetC1_1: rf_bpf (C1.1), rf_trsw (C81.1)
NetC2_1: rf_bpf (C2.1), rf_txmix (T4.4)
NetC78_2: rf_txpa (T7.4), rf_trsw (C78.2)
PA_BIAS: rf_txpa (C103.1 R83.2), rf_conn (P1.8)
PTT: rf_txpa (C94a.1 R73.2 R75.1), rf_bpf (C2c.1 U1.1 U2.1), rf_conn (U7.13)
PTT_N: rf_txpa (C102.2 U18.5), rf_bpf (C2d.1 U1.15 U2.15), rf_conn (R15a.2 U7.10 U7.11 U7.12), rf_txmix (U17.1 U17.15)